# Altium schematic sheet Lab3Part3.SchDoc
size A
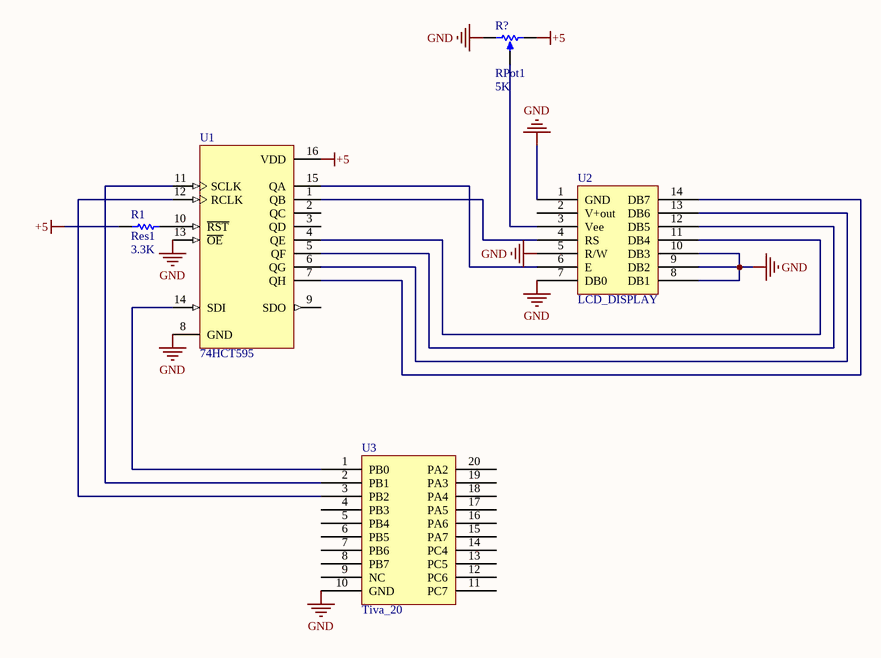
[diagram p0: Lab3Part3.SchDoc]

## Parts
R1  Res1  value 3.3K  [AXIAL-0.3]
R?  RPot1  value 5K  [VR5]
U1  74HCT595  [DIP-16/X1.5]
U2  LCD_DISPLAY
U3  Tiva_20

## Nets
+5: R1.1 R?.2(BOT) U1.16(VDD)
GND: R?.1(TOP) U1.8(GND) U1.13(~{OE}) U2.1(GND) U2.5(R/W) U2.7(DB0) U2.8(DB1) U2.9(DB2) U2.10(DB3) U3.10(GND)
NetR1_2: R1.2 U1.10(~{RST})
NetR?_3: R?.3(TAP) U2.3(Vee)
NetU1_1: U1.1(QB) U2.4(RS)
NetU1_4: U1.4(QE) U2.11(DB4)
NetU1_5: U1.5(QF) U2.12(DB5)
NetU1_6: U1.6(QG) U2.13(DB6)
NetU1_7: U1.7(QH) U2.14(DB7)
NetU1_11: U1.11(SCLK) U3.2(PB1)
NetU1_12: U1.12(RCLK) U3.3(PB2)
NetU1_14: U1.14(SDI) U3.1(PB0)
NetU1_15: U1.15(QA) U2.6(E)

Not connected (* = marked no-connect by the designer): U1 2(QC) 3(QD) 9(SDO); U2 2(V+out); U3 4(PB3) 5(PB4) 6(PB5) 7(PB6) 8(PB7) 9(NC) 11(PC7) 12(PC6) 13(PC5) 14(PC4) 15(PA7) 16(PA6) 17(PA5) 18(PA4) 19(PA3) 20(PA2)

## Library data of the parts
R1 = Res1: Resistor; Manufacturer: Generic Components; Class: Passive; Published: 08/06/2000; Publisher: Altium Hobart Technology Centre; SubClass: Resistor
R? = RPot1: Potentiometer; Manufacturer: Generic Components; Class: Passive; Set Position: 0.5; Published: 08/06/2000; Publisher: Altium Hobart Technology Centre; SubClass: Potentiometer
U1 = 74xxx595: 8-Bit Serial-Input/Serial or Prallel-Output Shift Register with Latched 3-State Outputs; Manufacturer: ON Semiconductor; Class: Logic; Published: 15/04/2002; Publisher: Altium Hobart Technology Centre; SubClass: Register
U2 = LCD_DISPLAY: LCD Display
U3 = Tiva_20: Tiva Protection 20 Pin Connector